# EasyEDA Pro project 外接板20260317.eprj, board PCB2
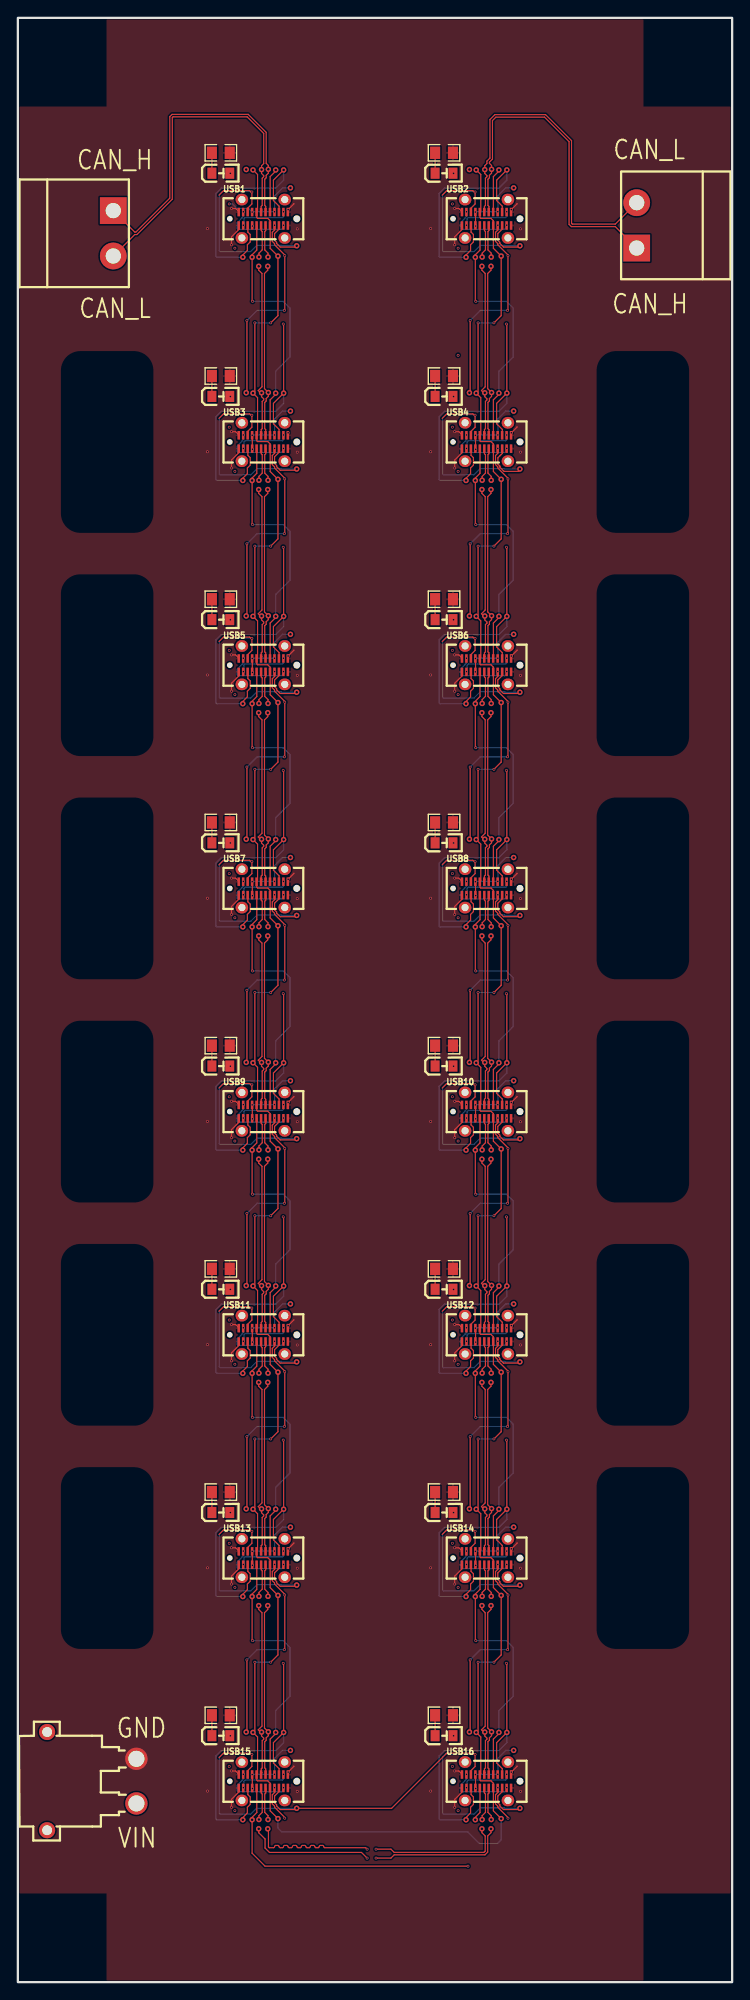
[diagram p1: board, top side]
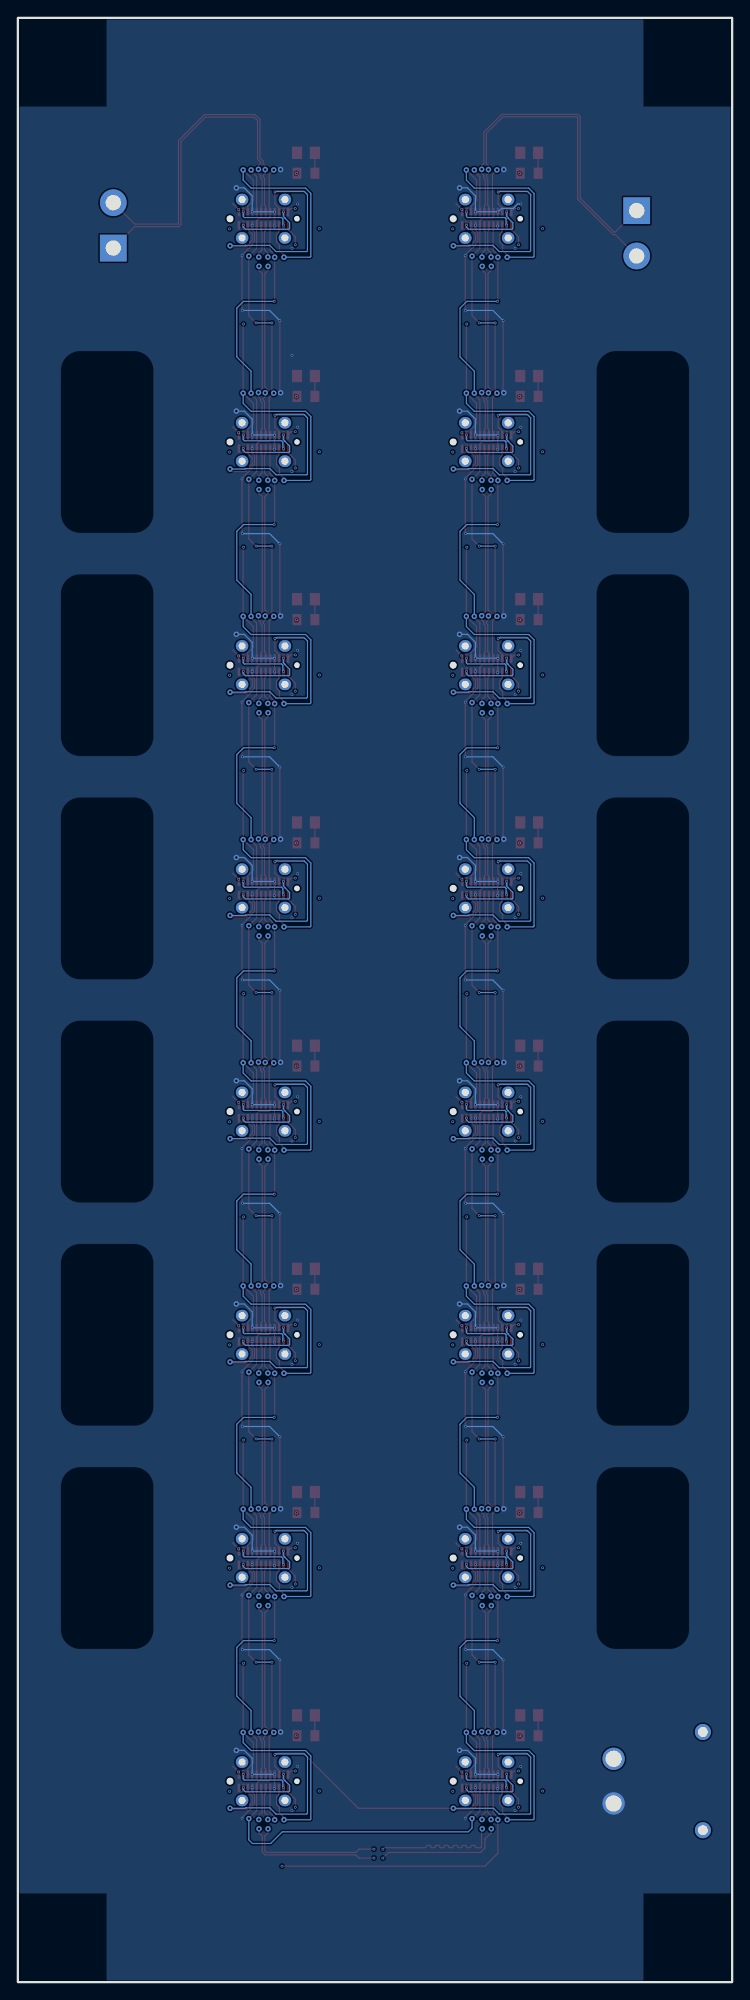
[diagram p2: board, bottom side, seen from below]

Outline 80 x 220 mm; copper layers: Top Layer, Inner1, Inner2, Bottom Layer. Coordinates in mm from the lower left corner of the outline.
Outline path: rectangle 0,220 80,0
Stack: Top Layer 0.035mm 外层铜厚1oz / Dielectric1 0.2104mm 7628 RC49% 8.6mil / Inner1 0.0152mm 内层铜厚 / Dielectric2 1.065mm 1.1mm H/HOZ Copper / Inner2 0.0152mm 内层铜厚 / Dielectric3 0.2104mm 7628 RC49% 8.6mil / Bottom Layer 0.035mm 外层铜厚1oz

## Design rules (mm)
net CAN_H: DP1
net CAN_L: DP1
template: 自定义配置
spacing copperThickness1oz (default): track to track 0.102, other pairs 0.152 to 0.3
spacing copperThickness2oz: track to track 0.203, other pairs 0.152 to 0.3
track width copperThickness1oz (default): min 0.127, default 0.127, max 2.54
track width copperThickness2oz: min 0.203, default 0.254, max 2.54
differential pair differentialPair (default): width min 0.127, default 0.254, max 2.54; gap min 0.152, default 0.152
via viaSize: diameter min 0.5, default 0.61, max 10; hole min 0.3, default 0.305, max 6.3
via viaSize1 (default): diameter min 0.25, default 0.3, max 10; hole min 0.15, default 0.2, max 6.3

## Placement (name value [footprint] x y rotation side)
CN1  XT30PW-M30.G.Y  [CONN-TH_XT30PW-M]  8.28 22.51 270 top
CN2  WJ2EDGRC-5.08-02P-14-00A  [CONN-TH_2P-P5.08_WJ2EDGRC-5.08-2P]  10.69 195.87 270 top
CN3  WJ2EDGRC-5.08-02P-14-00A  [CONN-TH_2P-P5.08_WJ2EDGRC-5.08-2P]  69.31 196.76 90 top
LED1  LS R976-NR-1-0-20-R18  [LED0805-RD_RED]  22.73 202.6 0 top
LED2  LS R976-NR-1-0-20-R18  [LED0805-RD_RED]  47.73 202.6 0 top
LED3  LS R976-NR-1-0-20-R18  [LED0805-RD_RED]  22.73 177.6 0 top
LED4  LS R976-NR-1-0-20-R18  [LED0805-RD_RED]  47.73 177.6 0 top
LED5  LS R976-NR-1-0-20-R18  [LED0805-RD_RED]  22.73 152.6 0 top
LED6  LS R976-NR-1-0-20-R18  [LED0805-RD_RED]  47.73 152.6 0 top
LED7  LS R976-NR-1-0-20-R18  [LED0805-RD_RED]  22.73 127.6 0 top
LED8  LS R976-NR-1-0-20-R18  [LED0805-RD_RED]  47.73 127.6 0 top
LED9  LS R976-NR-1-0-20-R18  [LED0805-RD_RED]  22.73 102.6 0 top
LED10  LS R976-NR-1-0-20-R18  [LED0805-RD_RED]  47.73 102.6 0 top
LED11  LS R976-NR-1-0-20-R18  [LED0805-RD_RED]  22.73 77.6 0 top
LED12  LS R976-NR-1-0-20-R18  [LED0805-RD_RED]  47.73 77.6 0 top
LED13  LS R976-NR-1-0-20-R18  [LED0805-RD_RED]  22.73 52.6 0 top
LED14  LS R976-NR-1-0-20-R18  [LED0805-RD_RED]  47.73 52.6 0 top
LED15  LS R976-NR-1-0-20-R18  [LED0805-RD_RED]  22.73 27.6 0 top
LED16  LS R976-NR-1-0-20-R18  [LED0805-RD_RED]  47.73 27.6 0 top
R1  1kΩ  [R0805]  22.73 204.89 0 top
R2  1kΩ  [R0805]  47.73 204.89 0 top
R3  1kΩ  [R0805]  22.73 179.89 0 top
R4  1kΩ  [R0805]  47.73 179.89 0 top
R5  1kΩ  [R0805]  22.73 154.89 0 top
R6  1kΩ  [R0805]  47.73 154.89 0 top
R7  1kΩ  [R0805]  22.73 129.89 0 top
R8  1kΩ  [R0805]  47.73 129.89 0 top
R9  1kΩ  [R0805]  22.73 104.89 0 top
R10  1kΩ  [R0805]  47.73 104.89 0 top
R11  1kΩ  [R0805]  22.73 79.89 0 top
R12  1kΩ  [R0805]  47.73 79.89 0 top
R13  1kΩ  [R0805]  22.73 54.89 0 top
R14  1kΩ  [R0805]  47.73 54.89 0 top
R15  1kΩ  [R0805]  22.73 29.89 0 top
R16  1kΩ  [R0805]  47.73 29.89 0 top
USB1  MC-236LS-L64  [TYPE-C-USB-SMD_TYPE-C-31-M-06]  27.49 197.5 0 top
USB2  MC-236LS-L64  [TYPE-C-USB-SMD_TYPE-C-31-M-06]  52.49 197.5 0 top
USB3  MC-236LS-L64  [TYPE-C-USB-SMD_TYPE-C-31-M-06]  27.49 172.5 0 top
USB4  MC-236LS-L64  [TYPE-C-USB-SMD_TYPE-C-31-M-06]  52.49 172.5 0 top
USB5  MC-236LS-L64  [TYPE-C-USB-SMD_TYPE-C-31-M-06]  27.49 147.5 0 top
USB6  MC-236LS-L64  [TYPE-C-USB-SMD_TYPE-C-31-M-06]  52.49 147.5 0 top
USB7  MC-236LS-L64  [TYPE-C-USB-SMD_TYPE-C-31-M-06]  27.49 122.5 0 top
USB8  MC-236LS-L64  [TYPE-C-USB-SMD_TYPE-C-31-M-06]  52.49 122.5 0 top
USB9  MC-236LS-L64  [TYPE-C-USB-SMD_TYPE-C-31-M-06]  27.49 97.5 0 top
USB10  MC-236LS-L64  [TYPE-C-USB-SMD_TYPE-C-31-M-06]  52.49 97.5 0 top
USB11  MC-236LS-L64  [TYPE-C-USB-SMD_TYPE-C-31-M-06]  27.49 72.5 0 top
USB12  MC-236LS-L64  [TYPE-C-USB-SMD_TYPE-C-31-M-06]  52.49 72.5 0 top
USB13  MC-236LS-L64  [TYPE-C-USB-SMD_TYPE-C-31-M-06]  27.49 47.5 0 top
USB14  MC-236LS-L64  [TYPE-C-USB-SMD_TYPE-C-31-M-06]  52.49 47.5 0 top
USB15  MC-236LS-L64  [TYPE-C-USB-SMD_TYPE-C-31-M-06]  27.49 22.5 0 top
USB16  MC-236LS-L64  [TYPE-C-USB-SMD_TYPE-C-31-M-06]  52.49 22.5 0 top

## Footprints (pads in the part's own frame, mm; a bottom-side part is the same pattern mirrored in y, then rotated)
CONN-TH_2P-P5.08_WJ2EDGRC-5.08-2P
  rect 3x3 hole 1.7: 1(-2.54,0)
  round 3 hole 1.7: 2(2.54,0)
CONN-TH_XT30PW-M
  round 2.5 hole 1.8: 1(-2.5,5) 2(2.5,5)
  round 1.8 hole 1.1: 3(5.5,-5) 4(-5.5,-5)
LED0805-RD_RED
  rect 1x1.25 smd: 1(-1,0) 2(1,0)
R0805
  rect 1.133x1.377 smd: 1(-1,0) 2(1,0)
TYPE-C-USB-SMD_TYPE-C-31-M-06
  oval 1.4x1.3 hole 0.8: 25(-2.401,2.15) 25(-2.401,-2.15) 25(2.399,2.15) 25(2.399,-2.15)
  rect 0.28x0.95 smd: A1(-2.751,0.75) A2(-2.251,0.75) A3(-1.751,0.75) A4(-1.251,0.75) A5(-0.751,0.75) A6(-0.251,0.75) A7(0.249,0.75) A8(0.749,0.75) A9(1.249,0.75) A10(1.749,0.75) A11(2.249,0.75) A12(2.749,0.75) B1(2.751,-0.751) B2(2.251,-0.751) B3(1.751,-0.751) B4(1.251,-0.751) B5(0.751,-0.751) B6(0.251,-0.751) B7(-0.249,-0.751) B8(-0.749,-0.751) B9(-1.249,-0.751) B10(-1.749,-0.751) B11(-2.249,-0.751) B12(-2.749,-0.751)

## Nets
As in the schematic.

Pads without a net: CN1 3 4; USB1 25; USB2 25; USB3 25; USB4 25; USB5 25; USB6 25; USB7 25; USB8 25; USB9 25; USB10 25; USB11 25; USB12 25; USB13 25; USB14 25; USB15 25; USB16 25

## Via types
v1: diameter 0.3, hole 0.2, Top Layer to Bottom Layer, 378 vias
v2: diameter 0.61, hole 0.305, Top Layer to Bottom Layer, 240 vias

## Routing (per net, layer and track width the routed paths; a pad name or vN(x,y) marks a point on that pad's centre or on a via; arc(x,y) is an arc through that point)
GND: length 181.9
  Top Layer w0.127: v1(48.93,148.65) 49.39,148.65 49.76,148.28 ; 24.76,148.28 24.39,148.65 v1(23.93,148.65) ; 49.76,21.78 49.76,21.31 48.93,20.47 v1(48.93,19.59) ; v1(55.27,98.53) 55.91,99.17 55.91,99.2 ; v1(55.27,148.53) 55.91,149.17 55.91,149.2 ; v1(48.93,23.65) 49.39,23.65 49.76,23.28 ; 49.76,171.78 49.76,171.31 48.93,170.47 v1(48.93,169.59) ; 24.76,123.28 24.39,123.65 v1(23.93,123.65) ; 49.76,96.78 49.76,96.31 48.93,95.47 v1(48.93,94.59) ; v1(48.93,173.65) 49.39,173.65 49.76,173.28 ; 49.76,123.28 49.39,123.65 v1(48.93,123.65) ; 30.91,149.2 30.91,149.17 v1(30.27,148.53) ; 55.91,199.2 55.91,199.17 v1(55.27,198.53) ; 24.76,96.78 24.76,96.31 23.93,95.47 v1(23.93,94.59) ; 55.91,124.2 55.91,124.17 v1(55.27,123.53) ; 49.76,71.78 49.76,71.31 48.93,70.47 v1(48.93,69.59) ; v1(23.93,19.59) 23.93,20.47 24.76,21.31 24.76,21.78 ; 24.76,71.78 24.76,71.31 23.93,70.47 v1(23.93,69.59) ; v1(23.93,48.65) 24.39,48.65 24.76,48.28 ; v1(55.27,173.53) 55.91,174.17 55.91,174.2 ; v1(23.93,144.59) 23.93,145.47 24.76,146.31 24.76,146.78 ; v1(30.27,198.53) 30.91,199.17 30.91,199.2 ; 49.76,73.28 49.39,73.65 v1(48.93,73.65) ; 49.76,98.28 49.39,98.65 v1(48.93,98.65) ; 49.76,196.78 49.76,196.31 48.93,195.47 v1(48.93,194.59) ; v1(55.27,48.53) 55.91,49.17 55.91,49.2 ; v1(55.27,23.53) 55.91,24.17 55.91,24.2 ; 30.91,99.2 30.91,99.17 v1(30.27,98.53) ; 24.76,98.28 24.39,98.65 v1(23.93,98.65) ; v1(23.93,173.65) 24.39,173.65 24.76,173.28 ; v1(23.93,198.65) 24.39,198.65 24.76,198.28 ; v1(48.93,44.59) 48.93,45.47 49.76,46.31 49.76,46.78 ; v1(23.93,119.59) 23.93,120.47 24.76,121.31 24.76,121.78 ; 49.76,121.78 49.76,121.31 48.93,120.47 v1(48.93,119.59) ; 49.76,198.28 49.39,198.65 v1(48.93,198.65) ; v1(48.93,144.59) 48.93,145.47 49.76,146.31 49.76,146.78 ; v1(23.93,23.65) 24.39,23.65 24.76,23.28 ; v1(30.27,48.53) 30.91,49.17 30.91,49.2 ; 30.91,24.2 30.91,24.17 v1(30.27,23.53) ; 49.76,48.28 49.39,48.65 v1(48.93,48.65) ; 30.91,124.2 30.91,124.17 v1(30.27,123.53) ; v1(23.93,169.59) 23.93,170.47 24.76,171.31 24.76,171.78 ; v1(23.93,73.65) 24.39,73.65 24.76,73.28 ; 24.76,46.78 24.76,46.31 23.93,45.47 v1(23.93,44.59) ; 55.91,74.2 55.91,74.17 v1(55.27,73.53) ; 30.91,74.2 30.91,74.17 v1(30.27,73.53) ; 24.76,196.78 24.76,196.31 23.93,195.47 v1(23.93,194.59)
  Inner2 w0.127: 47.78,196.47 47.72,196.4 v1(46.23,196.4) ; 22.78,96.47 22.72,96.4 v1(21.23,96.4) ; 47.78,146.47 47.72,146.4 v1(46.23,146.4) ; v1(21.23,71.4) 22.72,71.4 22.78,71.47 ; v1(23.93,123.65) 22.78,122.51 22.78,120.09 23.29,119.59 v1(23.93,119.59) ; v1(46.23,21.4) 47.72,21.4 47.78,21.47 ; v1(48.93,23.65) 47.78,22.51 47.78,20.09 48.29,19.59 v1(48.93,19.59) ; v1(21.23,21.4) 22.72,21.4 22.78,21.47 ; v1(46.23,121.4) 47.72,121.4 47.78,121.47 ; v1(46.23,71.4) 47.72,71.4 47.78,71.47 ; v1(23.93,69.59) 23.29,69.59 22.78,70.09 22.78,72.51 v1(23.93,73.65) ; v1(23.93,23.65) 22.78,22.51 22.78,20.09 23.29,19.59 v1(23.93,19.59) ; 22.78,46.47 22.72,46.4 v1(21.23,46.4) ; v1(48.93,48.65) 47.78,47.51 47.78,45.09 48.29,44.59 v1(48.93,44.59) ; v1(48.93,119.59) 48.29,119.59 47.78,120.09 47.78,122.51 v1(48.93,123.65) ; v1(48.93,69.59) 48.29,69.59 47.78,70.09 47.78,72.51 v1(48.93,73.65) ; v1(21.23,196.4) 22.72,196.4 22.78,196.47 ; v1(46.23,96.4) 47.72,96.4 47.78,96.47 ; v1(23.93,48.65) 22.78,47.51 22.78,45.09 23.29,44.59 v1(23.93,44.59) ; v1(23.93,198.65) 22.78,197.51 22.78,195.09 23.29,194.59 v1(23.93,194.59) ; v1(48.93,144.59) 48.29,144.59 47.78,145.09 47.78,147.51 v1(48.93,148.65) ; v1(21.23,171.4) 22.72,171.4 22.78,171.47 ; v1(46.23,46.4) 47.72,46.4 47.78,46.47 ; v1(48.93,194.59) 48.29,194.59 47.78,195.09 47.78,197.51 v1(48.93,198.65) ; 22.78,121.47 22.72,121.4 v1(21.23,121.4) ; v1(48.93,98.65) 47.78,97.51 47.78,95.09 48.29,94.59 v1(48.93,94.59) ; v1(23.93,169.59) 23.29,169.59 22.78,170.09 22.78,172.51 v1(23.93,173.65) ; v1(23.93,94.59) 23.29,94.59 22.78,95.09 22.78,97.51 v1(23.93,98.65) ; 22.78,146.47 22.72,146.4 v1(21.23,146.4) ; v1(48.93,173.65) 47.78,172.51 47.78,170.09 48.29,169.59 v1(48.93,169.59) ; v1(23.93,144.59) 23.29,144.59 22.78,145.09 22.78,147.51 v1(23.93,148.65) ; 47.78,171.47 47.72,171.4 v1(46.23,171.4)
  vias: v1(30.27,173.53) v1(31.29,196.36) v1(31.29,171.36) v1(31.29,146.36) v1(31.29,121.36) v1(31.29,96.36) v1(31.29,71.36) v1(31.29,46.36) v1(31.29,21.36) v1(56.29,196.36) v1(56.29,171.36) v1(56.29,146.36) v1(56.29,121.36) v1(56.29,96.36) v1(56.29,71.36) v1(56.29,46.36) v1(56.29,21.36)
VCC3_3V: length 750.2
  Top Layer w0.127: v2(25.2,18.19) 25.2,18.44 25.7,18.95 25.7,19.59 26.02,19.91 26.02,20.74 25.76,21 25.76,21.78 ; v2(50.2,118.19) 50.2,118.44 50.7,118.95 50.7,119.59 51.02,119.91 51.02,120.74 50.76,121 50.76,121.78 ; 54.26,148.28 54.26,148.91 53.62,149.54 53.62,151.82 v2(54.77,152.97) 54.77,160.66 v1(54.72,160.71) ; 54.26,123.28 54.26,123.91 53.62,124.54 53.62,126.82 v2(54.77,127.97) 54.77,135.66 v1(54.72,135.71) ; 54.26,173.28 54.26,173.91 53.62,174.54 53.62,176.82 v2(54.77,177.97) 54.77,185.66 v1(54.72,185.71) ; 25.76,121.78 25.76,121 26.02,120.74 26.02,119.91 25.7,119.59 25.7,118.95 25.2,118.44 v2(25.2,118.19) ; 29.26,48.28 29.26,48.91 28.62,49.54 28.62,51.82 v2(29.77,52.97) 29.77,60.66 v1(29.72,60.71) ; 29.26,123.28 29.26,123.91 28.62,124.54 28.62,126.82 v2(29.77,127.97) 29.77,135.66 v1(29.72,135.71) ; 50.76,146.78 50.76,146 51.02,145.74 51.02,144.91 50.7,144.59 50.7,143.95 50.2,143.44 v2(50.2,143.19) ; v2(25.2,143.19) 25.2,143.44 25.7,143.95 25.7,144.59 26.02,144.91 26.02,145.74 25.76,146 25.76,146.78 ; v1(29.72,110.71) 29.77,110.66 v2(29.77,102.97) 28.62,101.82 28.62,99.54 29.26,98.91 29.26,98.28 ; 25.76,71.78 25.76,71 26.02,70.74 26.02,69.91 25.7,69.59 25.7,68.95 25.2,68.44 v2(25.2,68.19) ; 29.26,148.28 29.26,148.91 28.62,149.54 28.62,151.82 v2(29.77,152.97) 29.77,160.66 v1(29.72,160.71) ; 50.76,171.78 50.76,171 51.02,170.74 51.02,169.91 50.7,169.59 50.7,168.95 50.2,168.44 v2(50.2,168.19) ; 29.26,173.28 29.26,173.91 28.62,174.54 28.62,176.82 v2(29.77,177.97) 29.77,185.66 v1(29.72,185.71) ; 54.26,98.28 54.26,98.91 53.62,99.54 53.62,101.82 v2(54.77,102.97) 54.77,110.66 v1(54.72,110.71) ; 54.26,198.28 54.26,198.91 53.62,199.54 53.62,201.82 v2(54.77,202.97) ; 54.26,48.28 54.26,48.91 53.62,49.54 53.62,51.82 v2(54.77,52.97) 54.77,60.66 v1(54.72,60.71) ; 50.76,46.78 50.76,46 51.02,45.74 51.02,44.91 50.7,44.59 50.7,43.95 50.2,43.44 v2(50.2,43.19) ; v2(50.2,18.19) 50.2,18.44 50.7,18.95 50.7,19.59 51.02,19.91 51.02,20.74 50.76,21 50.76,21.78 ; v2(25.2,193.19) 25.2,193.44 25.7,193.95 25.7,194.59 26.02,194.91 26.02,195.74 25.76,196 25.76,196.78 ; 54.26,23.28 54.26,23.91 53.62,24.54 53.62,26.82 v2(54.77,27.97) 54.77,35.66 v1(54.72,35.71) ; 50.76,96.78 50.76,96 51.02,95.74 51.02,94.91 50.7,94.59 50.7,93.95 50.2,93.44 v2(50.2,93.19) ; 25.76,46.78 25.76,46 26.02,45.74 26.02,44.91 25.7,44.59 25.7,43.95 25.2,43.44 v2(25.2,43.19) ; v1(29.72,35.71) 29.77,35.66 v2(29.77,27.97) 28.62,26.82 28.62,24.54 29.26,23.91 29.26,23.28 ; 50.76,196.78 50.76,196 51.02,195.74 51.02,194.91 50.7,194.59 50.7,193.95 50.2,193.44 v2(50.2,193.19) ; 50.76,71.78 50.76,71 51.02,70.74 51.02,69.91 50.7,69.59 50.7,68.95 50.2,68.44 v2(50.2,68.19) ; v1(54.72,85.71) 54.77,85.66 v2(54.77,77.97) 53.62,76.82 53.62,74.54 54.26,73.91 54.26,73.28 ; v2(25.2,168.19) 25.2,168.44 25.7,168.95 25.7,169.59 26.02,169.91 26.02,170.74 25.76,171 25.76,171.78 ; v2(29.77,202.97) 28.62,201.82 28.62,199.54 29.26,198.91 29.26,198.28 ; v1(29.72,85.71) 29.77,85.66 v2(29.77,77.97) 28.62,76.82 28.62,74.54 29.26,73.91 29.26,73.28 ; v2(25.2,93.19) 25.2,93.44 25.7,93.95 25.7,94.59 26.02,94.91 26.02,95.74 25.76,96 25.76,96.78
  Inner1 w0.127: v2(25.2,18.19) 25.2,17.13 26.54,15.78 49.02,15.78 50.2,16.96 v2(50.2,18.19) ; 25.02,143.01 25.02,137.87 25.53,137.36 28.07,137.36 v1(29.72,135.71) ; 50.02,43.01 50.02,37.87 50.53,37.36 53.07,37.36 v1(54.72,35.71) ; 25.02,168.01 25.02,162.87 25.53,162.36 28.07,162.36 v1(29.72,160.71) ; 50.02,68.01 50.02,62.87 50.53,62.36 53.07,62.36 v1(54.72,60.71) ; v1(29.72,60.71) 28.07,62.36 25.53,62.36 25.02,62.87 25.02,68.01 ; v2(25.2,193.19) 25.02,193.01 25.02,187.87 25.53,187.36 28.07,187.36 v1(29.72,185.71) ; v1(29.72,35.71) 28.07,37.36 25.53,37.36 25.02,37.87 25.02,43.01 ; 25.02,118.01 25.02,112.87 25.53,112.36 28.07,112.36 v1(29.72,110.71) ; v1(54.72,135.71) 53.07,137.36 50.53,137.36 50.02,137.87 50.02,143.01 ; v1(29.72,85.71) 28.07,87.36 25.53,87.36 25.02,87.87 25.02,93.01 ; 50.02,193.01 50.02,187.87 50.53,187.36 53.07,187.36 v1(54.72,185.71) ; 50.02,93.01 50.02,87.87 50.53,87.36 53.07,87.36 v1(54.72,85.71) ; 50.02,118.01 50.02,112.87 50.53,112.36 53.07,112.36 v1(54.72,110.71) ; v1(54.72,160.71) 53.07,162.36 50.53,162.36 50.02,162.87 50.02,168.01
  Bottom Layer w0.127: v2(54.77,152.97) 54.77,151.82 53.88,150.94 47.78,150.94 47.19,150.34 47.19,143.28 47.27,143.19 v2(50.2,143.19) ; v2(29.77,152.97) 29.77,151.82 28.88,150.94 22.78,150.94 22.19,150.34 22.19,143.28 22.27,143.19 v2(25.2,143.19) ; v2(29.77,27.97) 29.77,26.82 28.88,25.94 22.78,25.94 22.19,25.34 22.19,18.28 22.27,18.19 v2(25.2,18.19) ; v2(50.2,68.19) 47.27,68.19 47.19,68.28 47.19,75.34 47.78,75.94 53.88,75.94 54.77,76.82 v2(54.77,77.97) ; v2(54.77,52.97) 54.77,51.82 53.88,50.94 47.78,50.94 47.19,50.34 47.19,43.28 47.27,43.19 v2(50.2,43.19) ; v2(54.77,27.97) 54.77,26.82 53.88,25.94 47.78,25.94 47.19,25.34 47.19,18.28 47.27,18.19 v2(50.2,18.19) ; v2(50.2,168.19) 47.27,168.19 47.19,168.28 47.19,175.34 47.78,175.94 53.88,175.94 54.77,176.82 v2(54.77,177.97) ; v2(25.2,168.19) 22.27,168.19 22.19,168.28 22.19,175.34 22.78,175.94 28.88,175.94 29.77,176.82 v2(29.77,177.97) ; v2(54.77,202.97) 54.77,201.82 53.88,200.94 47.78,200.94 47.19,200.34 47.19,193.28 47.27,193.19 v2(50.2,193.19) ; v2(29.77,127.97) 29.77,126.82 28.88,125.94 22.78,125.94 22.19,125.34 22.19,118.28 22.27,118.19 v2(25.2,118.19) ; v2(29.77,202.97) 29.77,201.82 28.88,200.94 22.78,200.94 22.19,200.34 22.19,193.28 22.27,193.19 v2(25.2,193.19) ; v2(29.77,52.97) 29.77,51.82 28.88,50.94 22.78,50.94 22.19,50.34 22.19,43.28 22.27,43.19 v2(25.2,43.19) ; v2(29.77,102.97) 29.77,101.82 28.88,100.94 22.78,100.94 22.19,100.34 22.19,93.28 22.27,93.19 v2(25.2,93.19) ; v2(50.2,118.19) 47.27,118.19 47.19,118.28 47.19,125.34 47.78,125.94 53.88,125.94 54.77,126.82 v2(54.77,127.97) ; v2(50.2,93.19) 47.27,93.19 47.19,93.28 47.19,100.34 47.78,100.94 53.88,100.94 54.77,101.82 v2(54.77,102.97) ; v2(25.2,68.19) 22.27,68.19 22.19,68.28 22.19,75.34 22.78,75.94 28.88,75.94 29.77,76.82 v2(29.77,77.97)
VIN: length 676.5
  Top Layer w0.127: 51.26,98.28 51.26,98.28 51.26,96.78 ; v2(25.58,178.01) 25.65,178.09 v1(25.65,186.09) ; 54.89,193.44 53.75,194.59 53.75,194.71 53.5,194.97 53.5,195.98 53.76,196.24 v1(53.76,196.78) ; v1(29.89,143.36) 29.89,137.28 v1(29.84,137.23) ; 29.89,93.44 28.75,94.59 28.75,94.71 28.5,94.97 28.5,95.98 28.76,96.24 v1(28.76,96.78) ; v1(28.76,21.78) 28.76,21.24 28.5,20.98 28.5,19.97 28.75,19.71 28.75,19.59 29.89,18.44 ; v1(29.84,62.23) 29.89,62.28 v1(29.89,68.36) ; 26.26,46.78 26.26,48.28 26.26,48.28 ; 54.89,143.44 53.75,144.59 53.75,144.71 53.5,144.97 53.5,145.98 53.76,146.24 v1(53.76,146.78) ; 26.26,21.78 26.26,23.28 26.26,23.28 ; v1(25.65,161.09) 25.65,153.09 ; 54.89,168.44 53.75,169.59 53.75,169.71 53.5,169.97 53.5,170.98 53.76,171.24 v1(53.76,171.78) ; v1(54.89,143.36) 54.89,137.28 v1(54.84,137.23) ; 26.26,98.28 26.26,98.28 26.26,96.78 ; v1(29.89,168.36) 29.89,162.28 v1(29.84,162.23) ; v1(50.65,111.09) 50.65,103.09 ; 51.26,21.78 51.26,23.28 51.26,23.28 ; 54.89,43.44 53.75,44.59 53.75,44.71 53.5,44.97 53.5,45.98 53.76,46.24 v1(53.76,46.78) ; v1(54.84,112.23) 54.89,112.28 v1(54.89,118.36) ; v1(28.76,121.78) 28.76,121.24 28.5,120.98 28.5,119.97 28.75,119.71 28.75,119.59 29.89,118.44 ; v1(50.65,136.09) 50.65,128.09 ; v1(25.65,86.09) 25.65,78.09 ; 51.26,196.78 51.26,198.28 51.26,198.28 ; 26.26,173.28 26.26,173.28 26.26,171.78 ; v1(28.76,146.78) 28.76,146.24 28.5,145.98 28.5,144.97 28.75,144.71 28.75,144.59 29.89,143.44 ; v1(54.89,43.36) 54.89,37.28 v1(54.84,37.23) ; v1(29.84,87.23) 29.89,87.28 v1(29.89,93.36) ; v1(54.89,93.36) 54.89,87.28 v1(54.84,87.23) ; v1(54.89,68.36) 54.89,62.28 v1(54.84,62.23) ; 26.26,146.78 26.26,148.28 26.26,148.28 ; v1(53.76,121.78) 53.76,121.24 53.5,120.98 53.5,119.97 53.75,119.71 53.75,119.59 54.89,118.44 ; v1(50.65,36.09) 50.65,28.09 ; 51.26,173.28 51.26,173.28 51.26,171.78 ; v1(28.76,171.78) 28.76,171.24 28.5,170.98 28.5,169.97 28.75,169.71 28.75,169.59 29.89,168.44 ; v1(28.76,196.78) 28.76,196.24 28.5,195.98 28.5,194.97 28.75,194.71 28.75,194.59 29.89,193.44 ; v1(50.65,186.09) 50.65,178.09 ; 26.26,73.28 26.26,73.28 26.26,71.78 ; v1(29.89,43.36) 29.89,37.28 v1(29.84,37.23) ; 51.26,71.78 51.26,73.28 51.26,73.28 ; 51.26,121.78 51.26,123.28 51.26,123.28 ; 29.89,43.44 28.75,44.59 28.75,44.71 28.5,44.97 28.5,45.98 28.76,46.24 v1(28.76,46.78) ; v1(50.65,61.09) 50.65,53.09 ; v1(53.76,21.78) 53.76,21.24 53.5,20.98 53.5,19.97 53.75,19.71 53.75,19.59 54.89,18.44 ; v1(29.89,193.36) 29.89,187.28 v1(29.84,187.23) ; 54.89,93.44 53.75,94.59 53.75,94.71 53.5,94.97 53.5,95.98 53.76,96.24 v1(53.76,96.78) ; v1(25.65,111.09) 25.65,103.09 ; v1(54.89,168.36) 54.89,162.28 v1(54.84,162.23) ; 51.26,46.78 51.26,48.28 51.26,48.28 ; 26.26,123.28 26.26,123.28 26.26,121.78 ; v1(50.65,161.09) 50.65,153.09 ; v1(25.65,136.09) 25.65,128.09 ; v1(53.76,71.78) 53.76,71.24 53.5,70.98 53.5,69.97 53.75,69.71 53.75,69.59 54.89,68.44 ; 51.26,148.28 51.26,148.28 51.26,146.78 ; v1(29.84,112.23) 29.89,112.28 v1(29.89,118.36) ; v1(25.65,61.09) 25.65,53.09 ; v1(54.84,187.23) 54.89,187.28 v1(54.89,193.36) ; v1(50.65,86.09) 50.65,78.09 ; v1(28.76,71.78) 28.76,71.24 28.5,70.98 28.5,69.97 28.75,69.71 28.75,69.59 29.89,68.44 ; v1(25.65,36.09) 25.65,28.09
  Inner1 w0.127: v1(26.29,196.69) 26.16,196.56 26.16,194.22 26.15,194.2 v1(24.31,194.2) ; v1(28.76,121.78) 28.76,123.28 v1(28.76,123.28) ; v2(50.58,203.01) 50.58,202.02 50.27,201.71 49.64,201.71 49,201.08 49,199.49 v1(48.67,199.16) 49.25,199.16 49.64,198.77 51.03,198.77 51.24,198.56 v1(51.24,198.25) ; v1(28.76,71.78) 28.76,73.28 v1(28.76,73.28) ; v1(51.29,46.69) 51.16,46.56 51.16,44.22 51.15,44.2 v1(49.31,44.2) ; v1(28.76,196.78) 28.76,198.28 v1(28.76,198.28) ; v1(28.76,21.78) 28.76,23.28 v1(28.76,23.28) ; v1(26.24,98.25) 26.24,98.56 26.03,98.77 24.64,98.77 24.25,99.16 v1(23.67,99.16) 24,99.49 24,101.08 24.64,101.71 25.27,101.71 25.58,102.02 v2(25.58,103.01) ; v1(24.31,19.2) 26.15,19.2 26.16,19.22 26.16,21.56 v1(26.29,21.69) ; v1(51.29,71.69) 51.16,71.56 51.16,69.22 51.15,69.2 v1(49.31,69.2) ; v1(28.76,98.28) 28.76,98.28 v1(28.76,96.78) ; v1(51.29,96.69) 51.16,96.56 51.16,94.22 51.15,94.2 v1(49.31,94.2) ; v1(51.29,171.69) 51.16,171.56 51.16,169.22 51.15,169.2 v1(49.31,169.2) ; v2(25.58,153.01) 25.58,152.02 25.27,151.71 24.64,151.71 24,151.08 24,149.49 v1(23.67,149.16) 24.25,149.16 24.64,148.77 26.03,148.77 26.24,148.56 v1(26.24,148.25) ; v2(50.58,103.01) 50.58,102.02 50.27,101.71 49.64,101.71 49,101.08 49,99.49 v1(48.67,99.16) 49.25,99.16 49.64,98.77 51.03,98.77 51.24,98.56 v1(51.24,98.25) ; v1(49.31,19.2) 51.15,19.2 51.16,19.22 51.16,21.56 v1(51.29,21.69) ; v1(26.24,48.25) 26.24,48.56 26.03,48.77 24.64,48.77 24.25,49.16 v1(23.67,49.16) 24,49.49 24,51.08 24.64,51.71 25.27,51.71 25.58,52.02 v2(25.58,53.01) ; v1(28.76,171.78) 28.76,173.28 v1(28.76,173.28) ; v1(28.76,48.28) 28.76,48.28 v1(28.76,46.78) ; v1(24.31,69.2) 26.15,69.2 26.16,69.22 26.16,71.56 v1(26.29,71.69) ; v1(49.31,194.2) 51.15,194.2 51.16,194.22 51.16,196.56 v1(51.29,196.69) ; v1(49.31,144.2) 51.15,144.2 51.16,144.22 51.16,146.56 51.29,146.69 ; v1(26.29,146.69) 26.16,146.56 26.16,144.22 26.15,144.2 v1(24.31,144.2) ; v1(48.67,149.16) 49.25,149.16 49.64,148.77 51.03,148.77 51.24,148.56 v1(51.24,148.25) ; v2(25.58,28.01) 25.58,27.02 25.27,26.71 24.64,26.71 24,26.08 24,24.49 v1(23.67,24.16) 24.25,24.16 24.64,23.77 26.03,23.77 26.24,23.56 v1(26.24,23.25) ; v1(53.76,171.78) 53.76,173.28 v1(53.76,173.28) ; v1(26.29,171.69) 26.16,171.56 26.16,169.22 26.15,169.2 v1(24.31,169.2) ; v1(51.24,73.25) 51.24,73.56 51.03,73.77 49.64,73.77 49.25,74.16 v1(48.67,74.16) 49,74.49 49,76.08 49.64,76.71 50.27,76.71 50.58,77.02 v2(50.58,78.01) ; v1(53.76,48.28) 53.76,48.28 v1(53.76,46.78) ; v1(53.76,146.78) 53.76,148.28 v1(53.76,148.28) ; v1(51.24,173.25) 51.24,173.56 51.03,173.77 49.64,173.77 49.25,174.16 v1(48.67,174.16) 49,174.49 49,176.08 49.64,176.71 50.27,176.71 50.58,177.02 v2(50.58,178.01) ; v1(26.24,173.25) 26.24,173.56 26.03,173.77 24.64,173.77 24.25,174.16 v1(23.67,174.16) 24,174.49 24,176.08 24.64,176.71 25.27,176.71 25.58,177.02 v2(25.58,178.01) ; v1(53.76,21.78) 53.76,23.28 v1(53.76,23.28) ; v1(24.31,94.2) 26.15,94.2 26.16,94.22 26.16,96.56 v1(26.29,96.69) ; v1(51.29,121.69) 51.16,121.56 51.16,119.22 51.15,119.2 v1(49.31,119.2) ; v1(51.24,123.25) 51.24,123.56 51.03,123.77 49.64,123.77 49.25,124.16 v1(48.67,124.16) 49,124.49 49,126.08 49.64,126.71 50.27,126.71 50.58,127.02 v2(50.58,128.01) ; v1(53.76,123.28) 53.76,123.28 v1(53.76,121.78) ; v1(53.76,98.28) 53.76,98.28 v1(53.76,96.78) ; v2(25.58,203.01) 25.58,202.02 25.27,201.71 24.64,201.71 24,201.08 24,199.49 v1(23.67,199.16) 24.25,199.16 24.64,198.77 26.03,198.77 26.24,198.56 v1(26.24,198.25) ; v2(25.58,128.01) 25.58,127.02 25.27,126.71 24.64,126.71 24,126.08 24,124.49 v1(23.67,124.16) 24.25,124.16 24.64,123.77 26.03,123.77 26.24,123.56 v1(26.24,123.25) ; v1(26.24,73.25) 26.24,73.56 26.03,73.77 24.64,73.77 24.25,74.16 v1(23.67,74.16) 24,74.49 24,76.08 24.64,76.71 25.27,76.71 25.58,77.02 v2(25.58,78.01) ; v1(51.24,23.25) 51.24,23.56 51.03,23.77 49.64,23.77 49.25,24.16 v1(48.67,24.16) 49,24.49 49,26.08 49.64,26.71 50.27,26.71 50.58,27.02 v2(50.58,28.01) ; v2(50.58,53.01) 50.58,52.02 50.27,51.71 49.64,51.71 49,51.08 49,49.49 v1(48.67,49.16) 49.25,49.16 49.64,48.77 51.03,48.77 51.24,48.56 v1(51.24,48.25) ; v1(26.29,46.69) 26.16,46.56 26.16,44.22 26.15,44.2 v1(24.31,44.2) ; v1(26.29,121.69) 26.16,121.56 26.16,119.22 26.15,119.2 v1(24.31,119.2) ; v1(28.76,148.28) 28.76,148.28 v1(28.76,146.78) ; v1(53.76,198.28) 53.76,198.28 v1(53.76,196.78) ; v1(53.76,73.28) 53.76,73.28 v1(53.76,71.78)
  Bottom Layer w0.127: v1(50.65,186.09) 51.8,187.23 v1(54.84,187.23) ; v1(29.84,112.23) 26.8,112.23 v1(25.65,111.09) ; 26.21,123.28 v1(28.76,123.28) 28.76,125.07 29.64,125.96 v2(30.53,125.96) ; v2(55.53,75.96) 54.64,75.96 53.76,75.07 v1(53.76,73.28) 51.21,73.28 ; v2(30.53,200.96) 29.64,200.96 28.76,200.07 v1(28.76,198.28) 26.21,198.28 ; v1(54.84,162.23) 51.8,162.23 v1(50.65,161.09) ; v2(30.53,175.96) 29.64,175.96 28.76,175.07 v1(28.76,173.28) 26.21,173.28 ; 26.21,98.28 v1(28.76,98.28) 28.76,100.07 29.64,100.96 v2(30.53,100.96) ; v1(29.84,37.23) 26.8,37.23 v1(25.65,36.09) ; v1(25.65,186.09) 26.8,187.23 v1(29.84,187.23) ; v1(54.84,112.23) 51.8,112.23 v1(50.65,111.09) ; v1(26.24,198.25) 26.21,198.28 ; 26.21,198.28 25.83,198.66 24.51,198.66 24.02,199.16 v1(23.67,199.16) ; v2(30.53,50.96) 29.64,50.96 28.76,50.07 v1(28.76,48.28) 26.21,48.28 ; 51.21,98.28 v1(53.76,98.28) 53.76,100.07 54.64,100.96 v2(55.53,100.96) ; 26.21,23.28 v1(28.76,23.28) 28.76,25.07 29.64,25.96 v2(30.53,25.96) ; v2(55.53,150.96) 54.64,150.96 53.76,150.07 v1(53.76,148.28) 51.21,148.28 ; v2(55.53,125.96) 54.64,125.96 53.76,125.07 v1(53.76,123.28) 51.21,123.28 ; 26.21,73.28 v1(28.76,73.28) 28.76,75.07 29.64,75.96 v2(30.53,75.96) ; v1(54.84,137.23) 51.8,137.23 v1(50.65,136.09) ; v1(29.84,137.23) 26.8,137.23 v1(25.65,136.09) ; 26.21,148.28 v1(28.76,148.28) 28.76,150.07 29.64,150.96 v2(30.53,150.96) ; v1(50.65,61.09) 51.8,62.23 v1(54.84,62.23) ; v1(25.65,161.09) 26.8,162.23 v1(29.84,162.23) ; 51.21,198.28 v1(53.76,198.28) 53.76,200.07 54.64,200.96 v2(55.53,200.96) ; v1(29.84,62.23) 26.8,62.23 v1(25.65,61.09) ; v2(55.53,50.96) 54.64,50.96 53.76,50.07 v1(53.76,48.28) 51.21,48.28 ; v1(50.65,36.09) 51.8,37.23 v1(54.84,37.23) ; 51.21,23.28 v1(53.76,23.28) 53.76,25.07 54.64,25.96 v2(55.53,25.96) ; v1(29.84,87.23) 26.8,87.23 v1(25.65,86.09) ; v1(50.65,86.09) 51.8,87.23 v1(54.84,87.23) ; v2(55.53,175.96) 54.64,175.96 53.76,175.07 v1(53.76,173.28) 51.21,173.28
  vias: v1(29.89,18.36) v1(49.31,182.2) v1(51.24,146.75) v1(54.89,18.36) v2(50.58,153.01)
CAN_H: length 629.1
  Top Layer w0.127: 52.26,121.78 52.26,121.18 52.37,121.07 52.37,119.01 52,118.65 v2(52,118.21) ; 27.26,46.78 27.26,46.18 27.37,46.07 27.37,44.01 27,43.65 v2(27,43.21) ; v2(27.99,192.17) 27.99,191.74 27.62,191.37 27.62,178.47 v2(28.05,178.04) 28.05,177.61 27.81,177.36 27.81,177.09 27.65,176.92 27.65,173.99 27.76,173.88 27.76,173.28 ; v2(27.99,67.17) 27.99,66.74 27.62,66.37 27.62,53.47 v2(28.05,53.04) 28.05,52.61 27.81,52.36 27.81,52.09 27.65,51.92 27.65,48.99 27.76,48.88 27.76,48.28 ; 27.26,196.78 27.26,196.18 27.37,196.07 27.37,194.01 27,193.65 v2(27,193.21) ; v2(52.99,42.17) 52.99,41.74 52.62,41.37 52.62,28.47 v2(53.05,28.04) 53.05,27.61 52.81,27.36 52.81,27.09 52.65,26.92 52.65,23.99 52.76,23.88 52.76,23.28 ; v2(27.99,167.17) 27.99,166.74 27.62,166.37 27.62,153.47 v2(28.05,153.04) 28.05,152.61 27.81,152.36 27.81,152.09 27.65,151.92 27.65,148.99 27.76,148.88 27.76,148.28 ; 52.76,198.28 52.76,198.88 52.65,198.99 52.65,201.92 52.81,202.09 52.81,202.36 53.05,202.61 v2(53.05,203.04) 53.05,203.47 52.81,203.71 52.81,203.84 53.16,204.18 53.16,208.5 53.54,208.88 58.98,208.88 61.73,206.13 61.73,196.87 61.99,196.62 66.91,196.62 CN3.1 ; v2(52.99,117.17) 52.99,116.74 52.62,116.37 52.62,103.47 v2(53.05,103.04) 53.05,102.61 52.81,102.36 52.81,102.09 52.65,101.92 52.65,98.99 52.76,98.88 52.76,98.28 ; v1(40.12,13.9) 41.78,13.9 42.14,14.26 52.31,14.26 52.62,14.56 52.62,16.37 52.99,16.74 v2(52.99,17.17) ; v2(52,143.21) 52,143.65 52.37,144.01 52.37,146.07 52.26,146.18 52.26,146.78 ; CN2.1 13.09,196.01 13.22,196.01 17.02,199.81 17.02,208.94 17.27,209.19 25.79,209.19 27.81,207.17 27.81,203.71 28.05,203.47 v2(28.05,203.04) 28.05,202.61 27.81,202.36 27.81,202.09 27.65,201.92 27.65,198.99 27.76,198.88 27.76,198.28 ; 52.26,96.78 52.26,96.18 52.37,96.07 52.37,94.01 52,93.65 v2(52,93.21) ; v2(27,143.21) 27,143.65 27.37,144.01 27.37,146.07 27.26,146.18 27.26,146.78 ; 52.76,148.28 52.76,148.88 52.65,148.99 52.65,151.92 52.81,152.09 52.81,152.36 53.05,152.61 v2(53.05,153.04) 52.62,153.47 52.62,166.37 52.99,166.74 v2(52.99,167.17) ; 52.76,123.28 52.76,123.88 52.65,123.99 52.65,126.92 52.81,127.09 52.81,127.36 53.05,127.61 v2(53.05,128.04) 52.62,128.47 52.62,141.37 52.99,141.74 v2(52.99,142.17) ; 52.76,48.28 52.76,48.88 52.65,48.99 52.65,51.92 52.81,52.09 52.81,52.36 53.05,52.61 v2(53.05,53.04) 52.62,53.47 52.62,66.37 52.99,66.74 v2(52.99,67.17) ; 27.26,71.78 27.26,71.18 27.37,71.07 27.37,69.01 27,68.65 v2(27,68.21) ; 27.76,123.28 27.76,123.88 27.65,123.99 27.65,126.92 27.81,127.09 27.81,127.36 28.05,127.61 v2(28.05,128.04) 27.62,128.47 27.62,141.37 27.99,141.74 v2(27.99,142.17) ; 27.26,96.78 27.26,96.18 27.37,96.07 27.37,94.01 27,93.65 v2(27,93.21) ; v2(52,193.21) 52,193.65 52.37,194.01 52.37,196.07 52.26,196.18 52.26,196.78 ; v2(52.99,192.17) 52.99,191.74 52.62,191.37 52.62,178.47 v2(53.05,178.04) 53.05,177.61 52.81,177.36 52.81,177.09 52.65,176.92 52.65,173.99 52.76,173.88 52.76,173.28 ; v2(52,168.21) 52,168.65 52.37,169.01 52.37,171.07 52.26,171.18 52.26,171.78 ; v2(27,168.21) 27,168.65 27.37,169.01 27.37,171.07 27.26,171.18 27.26,171.78 ; v2(27.99,42.17) 27.99,41.74 27.62,41.37 27.62,28.47 v2(28.05,28.04) 28.05,27.61 27.81,27.36 27.81,27.09 27.65,26.92 27.65,23.99 27.76,23.88 27.76,23.28 ; v2(27.99,117.17) 27.99,116.74 27.62,116.37 27.62,103.47 v2(28.05,103.04) 28.05,102.61 27.81,102.36 27.81,102.09 27.65,101.92 27.65,98.99 27.76,98.88 27.76,98.28 ; v2(52,68.21) 52,68.65 52.37,69.01 52.37,71.07 52.26,71.18 52.26,71.78 ; v1(39.12,14.9) 38.95,15.06 34.38,15.06 arc(34.29,15.1) 34.25,15.19 arc(34.22,15.28) 34.13,15.31 33.88,15.31 arc(33.79,15.28) 33.75,15.19 arc(33.72,15.1) 33.63,15.06 33.38,15.06 arc(33.29,15.1) 33.25,15.19 arc(33.22,15.28) 33.13,15.31 32.88,15.31 arc(32.79,15.28) 32.75,15.19 arc(32.72,15.1) 32.63,15.06 32.38,15.06 arc(32.29,15.1) 32.25,15.19 arc(32.22,15.28) 32.13,15.31 31.88,15.31 arc(31.79,15.28) 31.75,15.19 arc(31.72,15.1) 31.63,15.06 31.38,15.06 arc(31.29,15.1) 31.25,15.19 arc(31.22,15.28) 31.13,15.31 30.88,15.31 arc(30.79,15.28) 30.75,15.19 arc(30.72,15.1) 30.63,15.06 30.38,15.06 arc(30.29,15.1) 30.25,15.19 arc(30.22,15.28) 30.13,15.31 29.88,15.31 arc(29.79,15.28) 29.75,15.19 arc(29.72,15.1) 29.63,15.06 29.38,15.06 arc(29.29,15.1) 29.25,15.19 arc(29.22,15.28) 29.13,15.31 28.88,15.31 arc(28.79,15.28) 28.75,15.19 arc(28.72,15.1) 28.63,15.06 28.16,15.06 28.07,15.15 28.07,17.09 v2(27.99,17.17) ; 27.26,21.78 27.26,21.18 27.37,21.07 27.37,19.01 27,18.65 v2(27,18.21) ; v2(52.99,92.17) 52.99,91.74 52.62,91.37 52.62,78.47 v2(53.05,78.04) 53.05,77.61 52.81,77.36 52.81,77.09 52.65,76.92 52.65,73.99 52.76,73.88 52.76,73.28 ; v2(27,118.21) 27,118.65 27.37,119.01 27.37,121.07 27.26,121.18 27.26,121.78 ; 52.26,21.78 52.26,21.18 52.37,21.07 52.37,19.01 52,18.65 v2(52,18.21) ; v2(27.99,92.17) 27.99,91.74 27.62,91.37 27.62,78.47 v2(28.05,78.04) 28.05,77.61 27.81,77.36 27.81,77.09 27.65,76.92 27.65,73.99 27.76,73.88 27.76,73.28 ; 52.26,46.78 52.26,46.18 52.37,46.07 52.37,44.01 52,43.65 v2(52,43.21)
  Inner1 w0.127: v2(52.99,167.17) 52.99,167.23 v2(52,168.21) 52,176.98 52.5,177.49 52.51,177.49 52.81,177.79 52.81,177.8 v2(53.05,178.04) ; v2(28.05,53.04) 27.81,52.8 27.81,52.79 27.51,52.49 27.5,52.49 27,51.98 v2(27,43.21) 27.99,42.23 v2(27.99,42.17) ; v2(27.99,92.17) 27.99,92.23 v2(27,93.21) 27,101.98 27.5,102.49 27.51,102.49 27.81,102.79 27.81,102.8 v2(28.05,103.04) ; v2(52.99,92.17) 52.99,92.23 v2(52,93.21) 52,101.98 52.5,102.49 52.51,102.49 52.81,102.79 52.81,102.8 v2(53.05,103.04) ; v1(39.12,14.9) v1(40.12,13.9) ; v2(53.05,128.04) 52.81,127.8 52.81,127.79 52.51,127.49 52.5,127.49 52,126.98 v2(52,118.21) 52.99,117.23 v2(52.99,117.17) ; v2(52.99,17.17) 52.99,17.23 v2(52,18.21) 52,26.98 52.5,27.49 52.51,27.49 52.81,27.79 52.81,27.8 v2(53.05,28.04) ; v2(27.99,67.17) 27.99,67.23 v2(27,68.21) 27,76.98 27.5,77.49 27.51,77.49 27.81,77.79 27.81,77.8 v2(28.05,78.04) ; v2(27.99,142.17) 27.99,142.23 v2(27,143.21) 27,151.98 27.5,152.49 27.51,152.49 27.81,152.79 27.81,152.8 v2(28.05,153.04) ; v2(52.99,142.17) 52.99,142.23 v2(52,143.21) 52,151.98 52.5,152.49 52.51,152.49 52.81,152.79 52.81,152.8 v2(53.05,153.04) ; v2(27.99,192.17) 27.99,192.23 v2(27,193.21) 27,201.98 27.5,202.49 27.51,202.49 27.81,202.79 27.81,202.8 v2(28.05,203.04) ; v2(52.99,192.17) 52.99,192.23 v2(52,193.21) 52,201.98 52.5,202.49 52.51,202.49 52.81,202.79 52.81,202.8 v2(53.05,203.04) ; v2(27.99,17.17) 27.99,17.23 v2(27,18.21) 27,26.98 27.5,27.49 27.51,27.49 27.81,27.79 27.81,27.8 v2(28.05,28.04) ; v2(53.05,53.04) 52.81,52.8 52.81,52.79 52.51,52.49 52.5,52.49 52,51.98 v2(52,43.21) 52.99,42.23 v2(52.99,42.17) ; v2(28.05,178.04) 27.81,177.8 27.81,177.79 27.51,177.49 27.5,177.49 27,176.98 v2(27,168.21) 27.99,167.23 v2(27.99,167.17) ; v2(28.05,128.04) 27.81,127.8 27.81,127.79 27.51,127.49 27.5,127.49 27,126.98 v2(27,118.21) 27.99,117.23 v2(27.99,117.17) ; v2(53.05,78.04) 52.81,77.8 52.81,77.79 52.51,77.49 52.5,77.49 52,76.98 v2(52,68.21) 52.99,67.23 v2(52.99,67.17)
CAN_L: length 629.1
  Top Layer w0.127: v2(52.29,53.01) 52.29,52.57 52.53,52.33 52.53,52.21 52.37,52.04 52.37,48.99 52.26,48.88 52.26,48.4 ; v2(53.02,193.21) 53.02,193.65 52.65,194.01 52.65,196.07 52.76,196.18 52.76,196.78 ; 27.76,21.78 27.76,21.18 27.65,21.07 27.65,19.01 28.02,18.65 v2(28.02,18.21) ; v2(28.02,143.21) 28.02,143.65 27.65,144.01 27.65,146.07 27.76,146.18 27.76,146.78 ; CN2.2 13.09,195.73 13.33,195.73 17.3,199.69 17.3,208.82 17.39,208.91 25.68,208.91 27.53,207.06 27.53,203.68 27.29,203.44 v2(27.29,203.01) 27.29,202.57 27.53,202.33 27.53,202.21 27.37,202.04 27.37,198.99 27.26,198.88 27.26,198.4 ; 27.34,48.48 27.26,48.4 ; 27.26,48.4 27.26,48.28 ; 27.26,48.4 27.26,48.88 27.37,48.99 27.37,52.04 27.53,52.21 27.53,52.33 27.29,52.57 v2(27.29,53.01) ; 52.26,173.4 52.26,173.88 52.37,173.99 52.37,177.04 52.53,177.21 52.53,177.33 52.29,177.57 v2(52.29,178.01) ; 52.26,173.4 52.34,173.48 ; 52.26,173.4 52.26,173.28 ; 52.34,48.48 52.26,48.4 ; 52.26,48.4 52.26,48.28 ; v2(51.97,192.17) 51.97,191.74 52.34,191.37 52.34,178.68 51.92,178.26 52.18,178.01 ; v2(53.02,93.21) 53.02,93.65 52.65,94.01 52.65,96.07 52.76,96.18 52.76,96.78 ; v2(28.02,68.21) 28.02,68.65 27.65,69.01 27.65,71.07 27.76,71.18 27.76,71.78 ; 52.34,23.48 52.26,23.4 ; 52.26,23.4 52.26,23.88 52.37,23.99 52.37,27.04 52.53,27.21 52.53,27.33 52.29,27.57 v2(52.29,28.01) ; 52.26,23.4 52.26,23.28 ; 27.18,78.01 26.92,78.26 27.34,78.68 27.34,91.37 26.97,91.74 v2(26.97,92.17) ; 27.26,148.4 27.26,148.28 ; 27.26,148.4 27.26,148.88 27.37,148.99 27.37,152.04 27.53,152.21 27.53,152.33 27.29,152.57 v2(27.29,153.01) ; 27.26,148.4 27.34,148.48 ; 27.76,121.78 27.76,121.18 27.65,121.07 27.65,119.01 28.02,118.65 v2(28.02,118.21) ; v2(51.97,42.17) 51.97,41.74 52.34,41.37 52.34,28.68 51.92,28.26 52.18,28.01 ; 52.34,148.48 52.26,148.4 ; 52.26,148.4 52.26,148.28 ; 52.26,148.4 52.26,148.88 52.37,148.99 52.37,152.04 52.53,152.21 52.53,152.33 52.29,152.57 v2(52.29,153.01) ; v2(53.02,68.21) 53.02,68.65 52.65,69.01 52.65,71.07 52.76,71.18 52.76,71.78 ; 27.26,23.4 27.26,23.88 27.37,23.99 27.37,27.04 27.53,27.21 27.53,27.33 27.29,27.57 v2(27.29,28.01) ; 27.26,23.4 27.34,23.48 ; 27.26,23.4 27.26,23.28 ; v2(53.02,118.21) 53.02,118.65 52.65,119.01 52.65,121.07 52.76,121.18 52.76,121.78 ; 52.26,98.4 52.26,98.88 52.37,98.99 52.37,102.04 52.53,102.21 52.53,102.33 52.29,102.57 v2(52.29,103.01) ; 52.26,98.4 52.34,98.48 ; 52.26,98.4 52.26,98.28 ; 27.26,198.4 27.26,198.28 ; 27.26,198.4 27.34,198.48 ; 27.18,103.01 26.92,103.26 27.34,103.68 27.34,116.37 26.97,116.74 v2(26.97,117.17) ; v2(26.97,17.17) 26.97,16.74 27.69,16.03 27.69,15.02 28.18,14.53 38.49,14.53 v1(39.12,13.9) ; v2(26.97,67.17) 26.97,66.74 27.34,66.37 27.34,53.68 26.92,53.26 27.18,53.01 ; 52.34,123.48 52.26,123.4 ; 52.26,123.4 52.26,123.88 52.37,123.99 52.37,127.04 52.53,127.21 52.53,127.33 52.29,127.57 v2(52.29,128.01) ; 52.26,123.4 52.26,123.28 ; 52.34,198.48 52.26,198.4 ; 52.26,198.4 52.26,198.88 52.37,198.99 52.37,202.04 52.53,202.21 52.53,202.33 52.29,202.57 v2(52.29,203.01) 52.29,203.44 52.53,203.68 52.53,203.95 52.88,204.3 52.88,208.62 53.42,209.16 59.1,209.16 62.01,206.25 62.01,196.99 62.1,196.9 66.91,196.9 CN3.2 ; 52.26,198.4 52.26,198.28 ; v2(26.97,192.17) 26.97,191.74 27.34,191.37 27.34,178.68 26.92,178.26 27.18,178.01 v2(27.29,178.01) 27.29,177.57 27.53,177.33 27.53,177.21 27.37,177.04 27.37,173.99 27.26,173.88 27.26,173.4 ; v1(40.12,14.9) 41.78,14.9 42.14,14.53 52.2,14.53 52.34,14.68 52.34,16.37 51.97,16.74 v2(51.97,17.17) ; 27.26,98.4 27.26,98.28 ; 27.26,98.4 27.34,98.48 ; 27.26,98.4 27.26,98.88 27.37,98.99 27.37,102.04 27.53,102.21 27.53,102.33 27.29,102.57 v2(27.29,103.01) ; 27.26,73.4 27.26,73.28 ; 27.26,73.4 27.26,73.88 27.37,73.99 27.37,77.04 27.53,77.21 27.53,77.33 27.29,77.57 v2(27.29,78.01) ; 27.26,73.4 27.34,73.48 ; v2(53.02,168.21) 53.02,168.65 52.65,169.01 52.65,171.07 52.76,171.18 52.76,171.78 ; v2(28.02,168.21) 28.02,168.65 27.65,169.01 27.65,171.07 27.76,171.18 27.76,171.78 ; v2(51.97,92.17) 51.97,91.74 52.34,91.37 52.34,78.68 51.92,78.26 52.18,78.01 ; v2(53.02,43.21) 53.02,43.65 52.65,44.01 52.65,46.07 52.76,46.18 52.76,46.78 ; 52.76,146.78 52.76,146.18 52.65,146.07 52.65,144.01 53.02,143.65 v2(53.02,143.21) ; v2(52.29,78.01) 52.29,77.57 52.53,77.33 52.53,77.21 52.37,77.04 52.37,73.99 52.26,73.88 52.26,73.4 ; 27.18,153.01 26.92,153.26 27.34,153.68 27.34,166.37 26.97,166.74 v2(26.97,167.17) ; v2(28.02,93.21) 28.02,93.65 27.65,94.01 27.65,96.07 27.76,96.18 27.76,96.78 ; 27.18,28.01 26.92,28.26 27.34,28.68 27.34,41.37 26.97,41.74 v2(26.97,42.17) ; 52.18,53.01 51.92,53.26 52.34,53.68 52.34,66.37 51.97,66.74 v2(51.97,67.17) ; 27.18,128.01 26.92,128.26 27.34,128.68 27.34,141.37 26.97,141.74 v2(26.97,142.17) ; 52.18,103.01 51.92,103.26 52.34,103.68 52.34,116.37 51.97,116.74 v2(51.97,117.17) ; 52.76,21.78 52.76,21.18 52.65,21.07 52.65,19.01 53.02,18.65 v2(53.02,18.21) ; 27.26,173.4 27.26,173.28 ; 27.26,173.4 27.34,173.48 ; 52.18,128.01 51.92,128.26 52.34,128.68 52.34,141.37 51.97,141.74 v2(51.97,142.17) ; 27.76,196.78 27.76,196.18 27.65,196.07 27.65,194.01 28.02,193.65 v2(28.02,193.21) ; 52.26,73.4 52.26,73.28 ; 52.26,73.4 52.34,73.48 ; 52.18,153.01 51.92,153.26 52.34,153.68 52.34,166.37 51.97,166.74 v2(51.97,167.17) ; 27.76,46.78 27.76,46.18 27.65,46.07 27.65,44.01 28.02,43.65 v2(28.02,43.21) ; v2(27.29,128.01) 27.29,127.57 27.53,127.33 27.53,127.21 27.37,127.04 27.37,123.99 27.26,123.88 27.26,123.4 ; 27.34,123.48 27.26,123.4 ; 27.26,123.4 27.26,123.28
  Inner2 w0.127: v2(51.97,117.17) 51.98,117.17 v2(53.02,118.21) 53.02,127.28 v2(52.29,128.01) ; v2(51.97,92.17) 51.98,92.17 v2(53.02,93.21) 53.02,102.28 v2(52.29,103.01) ; v2(26.97,92.17) 26.98,92.17 v2(28.02,93.21) 28.02,102.28 v2(27.29,103.01) ; v2(52.29,153.01) 53.02,152.28 v2(53.02,143.21) 51.98,142.17 v2(51.97,142.17) ; v2(27.29,28.01) 28.02,27.28 v2(28.02,18.21) 26.98,17.17 v2(26.97,17.17) ; v2(52.29,28.01) 53.02,27.28 v2(53.02,18.21) 51.98,17.17 v2(51.97,17.17) ; v2(26.97,67.17) 26.98,67.17 v2(28.02,68.21) 28.02,77.28 v2(27.29,78.01) ; v2(26.97,42.17) 26.98,42.17 v2(28.02,43.21) 28.02,52.28 v2(27.29,53.01) ; v2(52.29,53.01) 53.02,52.28 v2(53.02,43.21) 51.98,42.17 v2(51.97,42.17) ; v2(51.97,67.17) 51.98,67.17 v2(53.02,68.21) 53.02,77.28 v2(52.29,78.01) ; v2(27.29,128.01) 28.02,127.28 v2(28.02,118.21) 26.98,117.17 v2(26.97,117.17) ; v2(26.97,142.17) 26.98,142.17 v2(28.02,143.21) 28.02,152.28 v2(27.29,153.01) ; v2(52.29,178.01) 53.02,177.28 v2(53.02,168.21) 51.98,167.17 v2(51.97,167.17) ; v1(39.12,13.9) v1(40.12,14.9) ; v2(51.97,192.17) 51.98,192.17 v2(53.02,193.21) 53.02,202.28 v2(52.29,203.01) ; v2(27.29,203.01) 28.02,202.28 v2(28.02,193.21) 26.98,192.17 v2(26.97,192.17) ; v2(26.97,167.17) 26.98,167.17 v2(28.02,168.21) 28.02,177.28 v2(27.29,178.01)
CLK: length 456
  Top Layer w0.127: v1(51.54,185.84) 51.54,178.17 ; v1(53.32,135.84) 54.13,136.65 v2(54.13,143.32) 53.26,144.19 53.26,147.27 52.99,147.54 51.85,147.54 51.76,147.63 51.76,148.28 51.85,148.37 51.85,152.46 v2(51.34,152.97) ; v2(51.34,52.97) 51.85,52.46 51.85,48.37 51.76,48.28 51.76,47.63 51.85,47.54 52.99,47.54 53.26,47.27 53.26,44.19 v2(54.13,43.32) 54.13,36.65 v1(53.32,35.84) ; v1(51.54,135.84) 51.54,128.17 ; v2(51.34,77.97) 51.85,77.46 51.85,73.37 51.76,73.28 51.76,72.63 51.85,72.54 52.99,72.54 53.26,72.27 53.26,69.19 v2(54.13,68.32) 54.13,61.65 v1(53.32,60.84) ; v2(51.34,102.97) 51.85,102.46 51.85,98.37 51.76,98.28 51.76,97.63 51.85,97.54 52.99,97.54 53.26,97.27 53.26,94.19 v2(54.13,93.32) 54.13,86.65 v1(53.32,85.84) ; v1(28.32,60.84) 29.13,61.65 v2(29.13,68.32) 28.26,69.19 28.26,72.27 27.99,72.54 26.85,72.54 26.76,72.63 26.76,73.28 26.85,73.37 26.85,77.46 v2(26.34,77.97) ; v1(28.32,185.84) 29.13,186.65 v2(29.13,193.32) 28.26,194.19 28.26,197.27 27.99,197.54 26.85,197.54 26.76,197.63 26.76,198.28 26.85,198.37 26.85,202.46 v2(26.34,202.97) ; v1(26.54,135.84) 26.54,128.17 ; v1(53.32,160.84) 54.13,161.65 v2(54.13,168.32) 53.26,169.19 53.26,172.27 52.99,172.54 51.85,172.54 51.76,172.63 51.76,173.28 51.85,173.37 51.85,177.46 v2(51.34,177.97) ; v2(29.13,18.32) 28.26,19.19 28.26,22.27 27.99,22.54 26.85,22.54 26.76,22.63 26.76,23.28 26.85,23.37 26.85,27.46 v2(26.34,27.97) ; v1(28.32,135.84) 29.13,136.65 v2(29.13,143.32) 28.26,144.19 28.26,147.27 27.99,147.54 26.85,147.54 26.76,147.63 26.76,148.28 26.85,148.37 26.85,152.46 v2(26.34,152.97) ; v2(54.13,18.32) 53.26,19.19 53.26,22.27 52.99,22.54 51.85,22.54 51.76,22.63 51.76,23.28 51.85,23.37 51.85,27.46 v2(51.34,27.97) ; v1(51.54,35.84) 51.54,28.17 ; v1(28.32,110.84) 29.13,111.65 v2(29.13,118.32) 28.26,119.19 28.26,122.27 27.99,122.54 26.85,122.54 26.76,122.63 26.76,123.28 26.85,123.37 26.85,127.46 v2(26.34,127.97) ; v1(26.54,60.84) 26.54,53.17 ; v2(26.34,52.97) 26.85,52.46 26.85,48.37 26.76,48.28 26.76,47.63 26.85,47.54 27.99,47.54 28.26,47.27 28.26,44.19 v2(29.13,43.32) 29.13,36.65 v1(28.32,35.84) ; v1(51.54,85.84) 51.54,78.17 ; v1(51.54,160.84) 51.54,153.17 ; v2(51.34,202.97) 51.85,202.46 51.85,198.37 51.76,198.28 51.76,197.63 51.85,197.54 52.99,197.54 53.26,197.27 53.26,194.19 v2(54.13,193.32) 54.13,186.65 v1(53.32,185.84) ; v2(51.34,127.97) 51.85,127.46 51.85,123.37 51.76,123.28 51.76,122.63 51.85,122.54 52.99,122.54 53.26,122.27 53.26,119.19 v2(54.13,118.32) 54.13,111.65 v1(53.32,110.84) ; v1(28.32,160.84) 29.13,161.65 v2(29.13,168.32) 28.26,169.19 28.26,172.27 27.99,172.54 26.85,172.54 26.76,172.63 26.76,173.28 26.85,173.37 26.85,177.46 v2(26.34,177.97) 26.54,178.17 v1(26.54,185.84) ; v1(26.54,35.84) 26.54,28.17 ; v2(26.34,102.97) 26.85,102.46 26.85,98.37 26.76,98.28 26.76,97.63 26.85,97.54 27.99,97.54 28.26,97.27 28.26,94.19 v2(29.13,93.32) 29.13,86.65 v1(28.32,85.84) ; v1(26.54,160.84) 26.54,153.17 ; v1(51.54,110.84) 51.54,103.17 ; v1(51.54,60.84) 51.54,53.17 ; v1(26.54,110.84) 26.54,103.17 ; v1(26.54,85.84) 26.54,78.17
  Bottom Layer w0.127: v1(53.32,85.84) v1(51.54,85.84) ; v1(28.32,110.84) v1(26.54,110.84) ; v1(53.32,35.84) v1(51.54,35.84) ; v1(53.32,160.84) v1(51.54,160.84) ; v1(28.32,85.84) v1(26.54,85.84) ; v1(53.32,60.84) v1(51.54,60.84) ; v2(54.13,18.32) 54.13,15.94 53.72,15.53 51.69,15.53 50.38,16.84 29.55,16.84 29.13,17.26 v2(29.13,18.32) ; v1(28.32,35.84) v1(26.54,35.84) ; v1(28.32,185.84) v1(26.54,185.84) ; v1(28.32,60.84) v1(26.54,60.84) ; v1(53.32,110.84) v1(51.54,110.84) ; v1(28.32,135.84) v1(26.54,135.84) ; v1(28.32,160.84) v1(26.54,160.84) ; v1(53.32,135.84) v1(51.54,135.84) ; v1(53.32,185.84) v1(51.54,185.84)
LED1: length 14
  Inner1 w0.127: v1(23.8,202.59) 22.97,201.76 22.97,197.57 23.22,197.33 23.22,197 23.2,196.99 23.55,196.99 23.76,196.78 v1(25.26,196.78)
  Bottom Layer w0.127: v1(29.76,198.28) 29.76,197.75 29.64,197.63 25.45,197.63 25.32,197.51 25.32,196.84 v1(25.26,196.78)
LED2: length 14
  Inner1 w0.127: v1(48.8,202.59) 47.97,201.76 47.97,197.57 48.22,197.33 48.22,197 48.2,196.99 48.55,196.99 48.76,196.78 v1(50.26,196.78)
  Bottom Layer w0.127: v1(50.26,196.78) 50.32,196.84 50.32,197.51 50.45,197.63 54.64,197.63 54.76,197.75 v1(54.76,198.28)
LED3: length 14
  Inner1 w0.127: v1(25.26,171.78) 23.76,171.78 23.55,171.99 23.2,171.99 23.22,172 23.22,172.33 22.97,172.57 22.97,176.76 v1(23.8,177.59)
  Bottom Layer w0.127: v1(25.26,171.78) 25.32,171.84 25.32,172.51 25.45,172.63 29.64,172.63 29.76,172.75 v1(29.76,173.28)
LED4: length 14.7
  Inner1 w0.127: 48.76,171.78 v1(50.26,171.78) ; 48.76,171.78 48.6,171.78 48.51,171.87 48.42,171.99 ; 48.76,171.78 48.55,171.99 48.42,171.99 ; 48.22,172.25 48.22,172.33 47.97,172.57 ; 48.22,172.25 47.97,172.57 ; 48.22,172.25 48.42,171.99 ; v1(48.8,177.59) 47.97,176.76 47.97,172.57
  Bottom Layer w0.127: v1(50.26,171.78) 50.32,171.84 50.32,172.51 50.45,172.63 54.64,172.63 54.76,172.75 v1(54.76,173.28)
LED5: length 14
  Inner1 w0.127: v1(23.8,152.59) 22.97,151.76 22.97,147.57 23.22,147.33 23.22,147 23.2,146.99 23.55,146.99 23.76,146.78 v1(25.26,146.78)
  Bottom Layer w0.127: v1(25.26,146.78) 25.32,146.84 25.32,147.51 25.45,147.63 29.64,147.63 29.76,147.75 v1(29.76,148.28)
LED6: length 14
  Inner1 w0.127: v1(50.26,146.78) 48.76,146.78 48.55,146.99 48.2,146.99 48.22,147 48.22,147.33 47.97,147.57 47.97,151.76 v1(48.8,152.59)
  Bottom Layer w0.127: v1(50.26,146.78) 50.32,146.84 50.32,147.51 50.45,147.63 54.64,147.63 54.76,147.75 v1(54.76,148.28)
LED7: length 14
  Inner1 w0.127: v1(25.26,121.78) 23.76,121.78 23.55,121.99 23.2,121.99 23.22,122 23.22,122.33 22.97,122.57 22.97,126.76 v1(23.8,127.59)
  Bottom Layer w0.127: v1(25.26,121.78) 25.32,121.84 25.32,122.51 25.45,122.63 29.64,122.63 29.76,122.75 v1(29.76,123.28)
LED8: length 14
  Inner1 w0.127: v1(50.26,121.78) 48.76,121.78 48.55,121.99 48.2,121.99 48.22,122 48.22,122.33 47.97,122.57 47.97,126.76 v1(48.8,127.59)
  Bottom Layer w0.127: v1(54.76,123.28) 54.76,122.75 54.64,122.63 50.45,122.63 50.32,122.51 50.32,121.84 v1(50.26,121.78)
LED9: length 14
  Inner1 w0.127: v1(23.8,102.59) 22.97,101.76 22.97,97.57 23.22,97.33 23.22,97 23.2,96.99 23.55,96.99 23.76,96.78 v1(25.26,96.78)
  Bottom Layer w0.127: v1(25.26,96.78) 25.32,96.84 25.32,97.51 25.45,97.63 29.64,97.63 29.76,97.75 v1(29.76,98.28)
LED10: length 14
  Inner1 w0.127: v1(48.8,102.59) 47.97,101.76 47.97,97.57 48.22,97.33 48.22,97 48.2,96.99 48.55,96.99 48.76,96.78 v1(50.26,96.78)
  Bottom Layer w0.127: v1(54.76,98.28) 54.76,97.75 54.64,97.63 50.45,97.63 50.32,97.51 50.32,96.84 v1(50.26,96.78)
LED11: length 14
  Inner1 w0.127: v1(25.26,71.78) 23.76,71.78 23.55,71.99 23.2,71.99 23.22,72 23.22,72.33 22.97,72.57 22.97,76.76 v1(23.8,77.59)
  Bottom Layer w0.127: v1(29.76,73.28) 29.76,72.75 29.64,72.63 25.45,72.63 25.32,72.51 25.32,71.84 v1(25.26,71.78)
LED12: length 14
  Inner1 w0.127: v1(50.26,71.78) 48.76,71.78 48.55,71.99 48.2,71.99 48.22,72 48.22,72.33 47.97,72.57 47.97,76.76 v1(48.8,77.59)
  Bottom Layer w0.127: v1(50.26,71.78) 50.32,71.84 50.32,72.51 50.45,72.63 54.64,72.63 54.76,72.75 v1(54.76,73.28)
LED13: length 14
  Inner1 w0.127: v1(23.8,52.59) 22.97,51.76 22.97,47.57 23.22,47.33 23.22,47 23.2,46.99 23.55,46.99 23.76,46.78 v1(25.26,46.78)
  Bottom Layer w0.127: v1(25.26,46.78) 25.32,46.84 25.32,47.51 25.45,47.63 29.64,47.63 29.76,47.75 v1(29.76,48.28)
LED14: length 14
  Inner1 w0.127: v1(50.26,46.78) 48.76,46.78 48.55,46.99 48.2,46.99 48.22,47 48.22,47.33 47.97,47.57 47.97,51.76 v1(48.8,52.59)
  Bottom Layer w0.127: v1(54.76,48.28) 54.76,47.75 54.64,47.63 50.45,47.63 50.32,47.51 50.32,46.84 v1(50.26,46.78)
LED15: length 14
  Inner1 w0.127: v1(23.8,27.59) 22.97,26.76 22.97,22.57 23.22,22.33 23.22,22 23.2,21.99 23.55,21.99 23.76,21.78 v1(25.26,21.78)
  Bottom Layer w0.127: v1(25.26,21.78) 25.32,21.84 25.32,22.51 25.45,22.63 29.64,22.63 29.76,22.75 v1(29.76,23.28)
LED16: length 14
  Inner1 w0.127: v1(48.8,27.59) 47.97,26.76 47.97,22.57 48.22,22.33 48.22,22 48.2,21.99 48.55,21.99 48.76,21.78 v1(50.26,21.78)
  Bottom Layer w0.127: v1(54.76,23.28) 54.76,22.75 54.64,22.63 50.45,22.63 50.32,22.51 50.32,21.84 v1(50.26,21.78)
SWDIO_1: length 722.4
  Top Layer w0.127: 26.76,21.78 26.76,18.99 26.21,18.44 26.21,18.19 ; v2(53.88,177.97) 53.88,177.84 53.26,177.22 53.26,173.28 ; 28.26,73.28 28.26,77.22 28.88,77.84 v2(28.88,77.97) ; v2(26.24,143.19) 26.24,138.3 v1(26.29,138.25) ; v2(53.88,127.97) 53.88,127.84 53.26,127.22 53.26,123.28 ; v2(26.24,168.19) 26.24,163.3 v1(26.29,163.25) ; v2(51.24,93.19) 51.24,88.3 v1(51.29,88.25) ; 26.21,193.19 26.21,193.44 26.76,193.99 26.76,196.78 ; 51.76,146.78 51.76,143.99 51.21,143.44 51.21,143.19 ; 53.26,48.28 53.26,52.22 53.88,52.84 v2(53.88,52.97) ; v2(26.24,18.19) 26.24,14.44 27.69,12.99 v1(50.42,12.99) ; v1(51.29,63.25) 51.24,63.3 v2(51.24,68.19) ; v1(51.29,138.25) 51.24,138.3 v2(51.24,143.19) ; 51.21,93.19 51.21,93.44 51.76,93.99 51.76,96.78 ; v1(26.29,113.25) 26.24,113.3 v2(26.24,118.19) ; 28.26,123.28 28.26,127.22 28.88,127.84 v2(28.88,127.97) ; v1(26.29,63.25) 26.24,63.3 v2(26.24,68.19) ; 51.21,193.19 51.21,193.44 51.76,193.99 51.76,196.78 ; v2(28.88,102.97) 28.88,102.84 28.26,102.22 28.26,98.28 ; v1(26.29,38.25) 26.24,38.3 v2(26.24,43.19) ; v2(51.24,168.19) 51.24,163.3 v1(51.29,163.25) ; v1(51.29,38.25) 51.24,38.3 v2(51.24,43.19) ; 26.76,121.78 26.76,118.99 26.21,118.44 26.21,118.19 ; 26.21,93.19 26.21,93.44 26.76,93.99 26.76,96.78 ; 26.21,168.19 26.21,168.44 26.76,168.99 26.76,171.78 ; v1(26.29,188.25) 26.24,188.3 v2(26.24,193.19) ; 26.21,68.19 26.21,68.44 26.76,68.99 26.76,71.78 ; v1(51.29,188.25) 51.24,188.3 v2(51.24,193.19) ; 53.26,198.28 53.26,202.22 53.88,202.84 v2(53.88,202.97) ; 51.76,46.78 51.76,43.99 51.21,43.44 51.21,43.19 ; v2(53.88,77.97) 53.88,77.84 53.26,77.22 53.26,73.28 ; 28.26,23.28 28.26,27.22 28.88,27.84 v2(28.88,27.97) ; v2(26.24,93.19) 26.24,88.3 v1(26.29,88.25) ; 51.21,168.19 51.21,168.44 51.76,168.99 51.76,171.78 ; 51.76,21.78 51.76,18.99 51.21,18.44 51.21,18.19 ; v2(51.24,118.19) 51.24,113.3 v1(51.29,113.25) ; 51.21,118.19 51.21,118.44 51.76,118.99 51.76,121.78 ; v2(53.88,102.97) 53.88,102.84 53.26,102.22 53.26,98.28 ; 26.76,46.78 26.76,43.99 26.21,43.44 26.21,43.19 ; 51.21,68.19 51.21,68.44 51.76,68.99 51.76,71.78 ; v2(28.88,152.97) 28.88,152.84 28.26,152.22 28.26,148.28 ; v2(28.88,52.97) 28.88,52.84 28.26,52.22 28.26,48.28 ; 26.21,143.19 26.21,143.44 26.76,143.99 26.76,146.78 ; 28.26,198.28 28.26,202.22 28.88,202.84 v2(28.88,202.97) ; 53.26,23.28 53.26,27.22 53.88,27.84 v2(53.88,27.97) ; v2(53.88,152.97) 53.88,152.84 53.26,152.22 53.26,148.28 ; v2(28.88,177.97) 28.88,177.84 28.26,177.22 28.26,173.28
  Inner1 w0.127: v1(50.42,12.99) 51.05,13.62 51.05,18.01 v2(51.24,18.19)
  Inner2 w0.127: v2(28.88,202.97) 28.88,203.53 28.32,204.09 25.53,204.09 24.89,203.45 24.89,202.56 25.18,202.27 26.2,202.27 26.29,202.18 26.29,202.06 26.24,202 26.24,200.99 26.58,200.65 26.58,199.1 25.88,198.4 25.88,196.58 26.24,196.22 v2(26.24,193.19) ; v2(53.88,52.97) 53.88,53.53 53.32,54.09 50.53,54.09 49.89,53.45 49.89,52.56 50.18,52.27 51.2,52.27 51.29,52.18 51.29,52.06 51.24,52 51.24,50.99 51.58,50.65 51.58,49.1 50.88,48.4 50.88,46.58 51.24,46.22 v2(51.24,43.19) ; v2(51.24,68.19) 51.24,71.22 50.88,71.58 50.88,73.4 51.58,74.1 51.58,75.65 51.24,75.99 51.24,77 51.29,77.06 51.29,77.18 51.2,77.27 50.18,77.27 49.89,77.56 49.89,78.45 50.53,79.09 53.32,79.09 53.88,78.53 v2(53.88,77.97) ; v2(53.88,27.97) 53.88,28.53 53.32,29.09 50.53,29.09 49.89,28.45 49.89,27.56 50.18,27.27 51.2,27.27 51.29,27.18 51.29,27.06 51.24,27 51.24,25.99 51.58,25.65 51.58,24.1 50.88,23.4 50.88,21.58 51.24,21.22 v2(51.24,18.19) ; v2(26.24,168.19) 26.24,171.22 25.88,171.58 25.88,173.4 26.58,174.1 26.58,175.65 26.24,175.99 26.24,177 26.29,177.06 26.29,177.18 26.2,177.27 25.18,177.27 24.89,177.56 24.89,178.45 25.53,179.09 28.32,179.09 28.88,178.53 v2(28.88,177.97) ; v2(51.24,118.19) 51.24,121.22 50.88,121.58 50.88,123.4 51.58,124.1 51.58,125.65 51.24,125.99 51.24,127 51.29,127.06 51.29,127.18 51.2,127.27 50.18,127.27 49.89,127.56 49.89,128.45 50.53,129.09 53.32,129.09 53.88,128.53 v2(53.88,127.97) ; v2(28.88,127.97) 28.88,128.53 28.32,129.09 25.53,129.09 24.89,128.45 24.89,127.56 25.18,127.27 26.2,127.27 26.29,127.18 26.29,127.06 26.24,127 26.24,125.99 26.58,125.65 26.58,124.1 25.88,123.4 25.88,121.58 26.24,121.22 v2(26.24,118.19) ; v2(28.88,27.97) 28.88,28.53 28.32,29.09 25.53,29.09 24.89,28.45 24.89,27.56 25.18,27.27 26.2,27.27 26.29,27.18 26.29,27.06 26.24,27 26.24,25.99 26.58,25.65 26.58,24.1 25.88,23.4 25.88,21.58 26.24,21.22 v2(26.24,18.19) ; v2(28.88,102.97) 28.88,103.53 28.32,104.09 25.53,104.09 24.89,103.45 24.89,102.56 25.18,102.27 26.2,102.27 26.29,102.18 26.29,102.06 26.24,102 26.24,100.99 26.58,100.65 26.58,99.1 25.88,98.4 25.88,96.58 26.24,96.22 v2(26.24,93.19) ; v2(51.24,143.19) 51.11,143.32 51.11,145.97 50.75,146.33 50.75,148.15 50.88,148.27 50.88,148.4 51.09,148.62 51.22,148.62 51.45,148.85 51.45,150.22 51.58,150.35 51.58,150.65 51.11,151.12 51.11,151.75 51.16,151.8 51.16,151.93 51.07,152.02 50.06,152.02 49.76,152.31 49.76,153.2 50.4,153.83 53.19,153.83 53.75,153.28 53.75,153.09 v2(53.88,152.97) ; v2(26.24,68.19) 26.24,71.22 25.88,71.58 25.88,73.4 26.58,74.1 26.58,75.65 26.24,75.99 26.24,77 26.29,77.06 26.29,77.18 26.2,77.27 25.18,77.27 24.89,77.56 24.89,78.45 25.53,79.09 28.32,79.09 28.88,78.53 v2(28.88,77.97) ; v2(51.24,93.19) 51.24,96.22 50.88,96.58 50.88,98.4 51.58,99.1 51.58,100.65 51.24,100.99 51.24,102 51.29,102.06 51.29,102.18 51.2,102.27 50.18,102.27 49.89,102.56 49.89,103.45 50.53,104.09 53.32,104.09 53.88,103.53 v2(53.88,102.97) ; v2(28.88,152.97) 28.88,153.53 28.32,154.09 25.53,154.09 24.89,153.45 24.89,152.56 25.18,152.27 26.2,152.27 26.29,152.18 26.29,152.06 26.24,152 26.24,150.99 26.58,150.65 26.58,149.1 25.88,148.4 25.88,146.58 26.24,146.22 v2(26.24,143.19) ; v2(51.24,193.19) 51.24,196.22 50.88,196.58 50.88,198.4 51.58,199.1 51.58,200.65 51.24,200.99 51.24,202 51.29,202.06 51.29,202.18 51.2,202.27 50.18,202.27 49.89,202.56 49.89,203.45 50.53,204.09 53.32,204.09 53.88,203.53 v2(53.88,202.97) ; v2(51.24,168.19) 51.24,171.22 50.88,171.58 50.88,173.4 51.58,174.1 51.58,175.65 51.24,175.99 51.24,177 51.29,177.06 51.29,177.18 51.2,177.27 50.18,177.27 49.89,177.56 49.89,178.45 50.53,179.09 53.32,179.09 53.88,178.53 v2(53.88,177.97) ; v2(28.88,52.97) 28.88,53.53 28.32,54.09 25.53,54.09 24.89,53.45 24.89,52.56 25.18,52.27 26.2,52.27 26.29,52.18 26.29,52.06 26.24,52 26.24,50.99 26.58,50.65 26.58,49.1 25.88,48.4 25.88,46.58 26.24,46.22 v2(26.24,43.19)
  Bottom Layer w0.127: v1(51.29,113.25) 54.72,113.25 55.48,112.49 55.48,107.03 53.88,105.43 v2(53.88,102.97) ; v1(51.29,188.25) 54.72,188.25 55.48,187.49 55.48,182.03 53.88,180.43 v2(53.88,177.97) ; v2(28.88,102.97) 28.88,105.43 30.48,107.03 30.48,112.49 29.72,113.25 v1(26.29,113.25) ; v1(51.29,38.25) 54.72,38.25 55.48,37.49 55.48,32.03 53.88,30.43 v2(53.88,27.97) ; v1(26.29,188.25) 29.72,188.25 30.48,187.49 30.48,182.03 28.88,180.43 v2(28.88,177.97) ; v2(28.88,52.97) 28.88,55.43 30.48,57.03 30.48,62.49 29.72,63.25 v1(26.29,63.25) ; v1(26.29,138.25) 29.72,138.25 30.48,137.49 30.48,132.03 28.88,130.43 v2(28.88,127.97) ; v1(51.29,163.25) 54.72,163.25 55.48,162.49 55.48,157.03 53.88,155.43 v2(53.88,152.97) ; v2(28.88,152.97) 28.88,155.43 30.48,157.03 30.48,162.49 29.72,163.25 v1(26.29,163.25) ; v1(51.29,88.25) 54.72,88.25 55.48,87.49 55.48,82.03 53.88,80.43 v2(53.88,77.97) ; v2(28.88,77.97) 28.88,80.43 30.48,82.03 30.48,87.49 29.72,88.25 v1(26.29,88.25) ; v2(53.88,52.97) 53.88,55.43 55.48,57.03 55.48,62.49 54.72,63.25 v1(51.29,63.25) ; v1(51.29,138.25) 54.72,138.25 55.48,137.49 55.48,132.03 53.88,130.43 v2(53.88,127.97) ; v1(26.29,38.25) 29.72,38.25 30.48,37.49 30.48,32.03 28.88,30.43 v2(28.88,27.97)
